# EAGLE design shield-module (EAGLE 5.12)
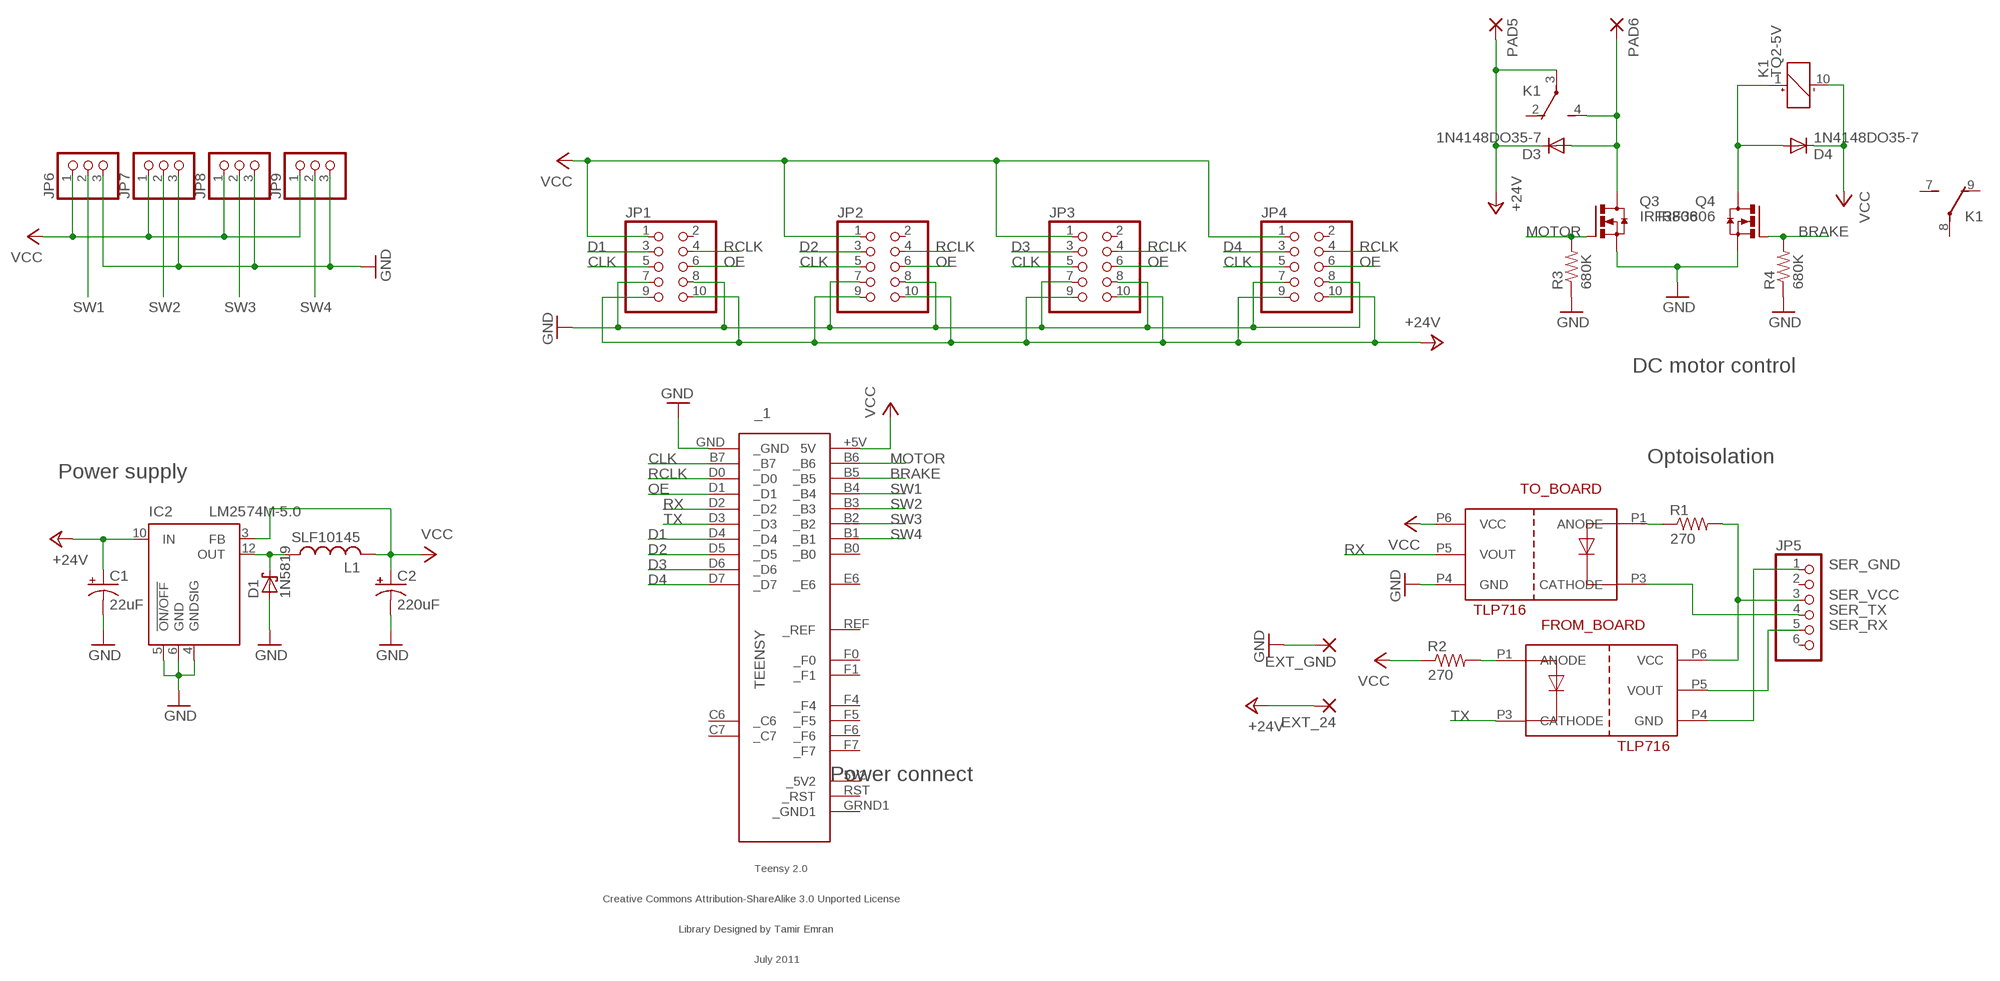
[diagram p0: schematic, sheet 1]

## Parts
_1  TEENSY  [TEENSY]
C1  22uF  CPOL-USSANYO_SMD_E7  [SANYO-OSCON_SMD_E7]
C2  220uF  CPOL-USSANYO_SMD_F8  [SANYO-OSCON_SMD_F8]
D1  1N5819  [SOD-123]
D3  1N4148DO35-7  DIODE-DO214AC  [DO214AC]
D4  1N4148DO35-7  DIODE-DO214AC  [DO214AC]
EXT_24  2,54/1,0  [2,54/1,0]
EXT_GND  2,54/1,0  [2,54/1,0]
FROM_BOARD  TLP716  [SDIP6]
IC2  LM2574M-5.0  [SO14W]
JP1  PINHD-2X5/90  [2X05/90]
JP2  PINHD-2X5/90  [2X05/90]
JP3  PINHD-2X5/90  [2X05/90]
JP4  PINHD-2X5/90  [2X05/90]
JP5  PINHD-1X6  [1X06]
JP6  PINHD-1X3  [1X03]
JP7  PINHD-1X3  [1X03]
JP8  PINHD-1X3  [1X03]
JP9  PINHD-1X3  [1X03]
K1  TQ2-5V  [TQ2]
L1  SLF10145  [SMD10145]
PAD5  2,54/1,0  [2,54/1,0]
PAD6  2,54/1,0  [2,54/1,0]
Q3  IRF3806  [DPAK]
Q4  IRF3806  [DPAK]
R1  270  R-US_R1206  [R1206]
R2  270  R-US_R1206  [R1206]
R3  680K  R-US_R1206  [R1206]
R4  680K  R-US_R1206  [R1206]
TO_BOARD  TLP716  [SDIP6]

## Nets
+24V: C1.+ D3.C EXT_24.1(P) IC2.10(IN) JP1.9 JP1.10 JP2.9 JP2.10 JP3.9 JP3.10 JP4.9 JP4.10 K1.3(1:P) PAD5.1(P)
BRAKE: _1.B5(_B5) Q4.1(G) R4.2
CLK: _1.B7(_B7) JP1.5 JP2.5 JP3.5 JP4.5
D1: _1.D4(_D4) JP1.3
D2: _1.D5(_D5) JP2.3
D3: _1.D6(_D6) JP3.3
D4: _1.D7(_D7) JP4.3
GND: _1.GND(_GND) C1.- C2.- D1.A EXT_GND.1(P) IC2.4(GNDSIG) IC2.5(!ON/OFF) IC2.6(GND) JP1.7 JP1.8 JP2.7 JP2.8 JP3.7 JP3.8 JP4.7 JP4.8 JP6.3 JP7.3 JP8.3 JP9.3 Q3.3(S) Q4.3(S) R3.1 R4.1 TO_BOARD.P4(GND)
MOTOR: _1.B6(_B6) Q3.1(G) R3.2
N$1: D1.C IC2.12(OUT) L1.P$1
N$3: R1.1 TO_BOARD.P1(ANODE)
N$7: FROM_BOARD.P1(ANODE) R2.2
N$53: D3.A K1.4(1:S) PAD6.1(P) Q3.4(D)
N$56: D4.A K1.1(_:+) Q4.4(D)
OE: _1.D1(_D1) JP1.6 JP2.6 JP3.6 JP4.6
RCLK: _1.D0(_D0) JP1.4 JP2.4 JP3.4 JP4.4
RX: _1.D2(_D2) TO_BOARD.P5(VOUT)
SER_GND: FROM_BOARD.P4(GND) JP5.1
SER_RX: FROM_BOARD.P5(VOUT) JP5.5
SER_TX: JP5.4 TO_BOARD.P3(CATHODE)
SER_VCC: FROM_BOARD.P6(VCC) JP5.3 R1.2
SW1: _1.B4(_B4) JP6.2
SW2: _1.B3(_B3) JP7.2
SW3: _1.B2(_B2) JP8.2
SW4: _1.B1(_B1) JP9.2
TX: _1.D3(_D3) FROM_BOARD.P3(CATHODE)
VCC: _1.+5V(5V) C2.+ D4.C IC2.3(FB) JP1.1 JP2.1 JP3.1 JP4.1 JP6.1 JP7.1 JP8.1 JP9.1 K1.10(_:-) L1.P$2 R2.1 TO_BOARD.P6(VCC)
Unconnected: _1.5V2(_5V2) _1.B0(_B0) _1.C6(_C6) _1.C7(_C7) _1.E6(_E6) _1.F0(_F0) _1.F1(_F1) _1.F4(_F4) _1.F5(_F5) _1.F6(_F6) _1.F7(_F7) _1.GRND1(_GND1) _1.REF(_REF) _1.RST(_RST) JP1.2 JP2.2 JP3.2 JP4.2 JP5.2 JP5.6 K1.2(1:O) K1.7(2:S) K1.8(2:P) K1.9(2:O)

## Notes on the sheet
- DC motor control
- Optoisolation
- Power supply
- SER_GND
- SER_VCC
- SER_TX
- SER_RX
- Power connect

## Library data of the parts
_1 = teensy:TEENSY: Teensy 2.0 Original Design by Clint Fisher Modified Design by Tamir Emran Licensed Under Creative Commons Attribution-ShareAlike 3.0 Unported (CC BY-SA 3.0)
C1 C2 = rcl:CPOL-US: POLARIZED CAPACITOR, American symbol
D1 = typewriter-project:1N5819
D3 D4 = diode:DIODE-: DIODE
EXT_24 EXT_GND PAD5 PAD6 = wirepad:2,54/1,0: THROUGH-HOLE PAD
FROM_BOARD TO_BOARD = typewriter-project:TLP716
IC2 = linear:LM2574?-*: SIMPLE SWITCHER 0.5A Step-Down Voltage Regulator Source: http://cache.national.com/ds/LM/LM2574.pdf
JP1-JP4 = pinhead:PINHD-2X5: PIN HEADER
JP5 = pinhead:PINHD-1X6: PIN HEADER
JP6-JP9 = pinhead:PINHD-1X3: PIN HEADER
K1 = relay:TQ2?*: LOW PROFILE 2 FORM C RELAY NAiS Source: http://www.mew-europe.com/.. en_ds_61020_0001.pdf Source: http://www.mew-europe.com/.. en_ds_61020_0004.pdf; MF: AROMAT/ MATSUSHITA; MPN: TQ2-5V; OC_FARNELL: 1175716; OC_NEWARK: 64K3200
L1 = typewriter-project:SLF10145
Q3 Q4 = typewriter-project:IRF*3806
R1-R4 = rcl:R-US_: RESISTOR, American symbol

## Board
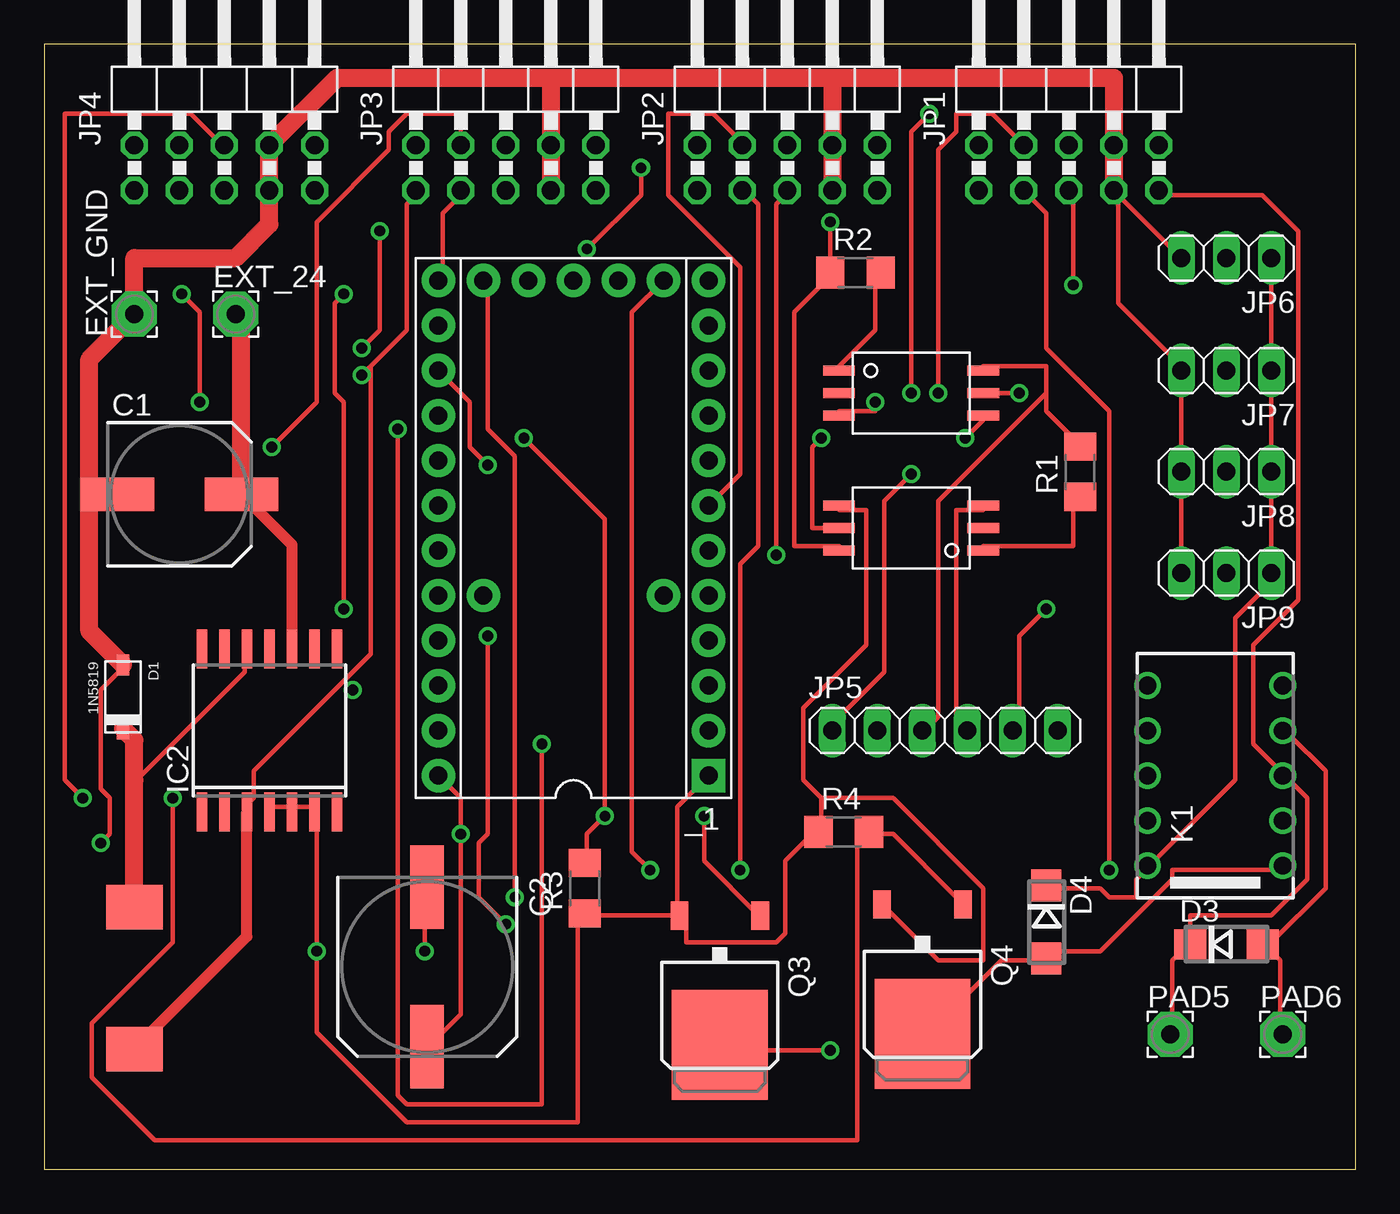
[diagram p1: board, top side]
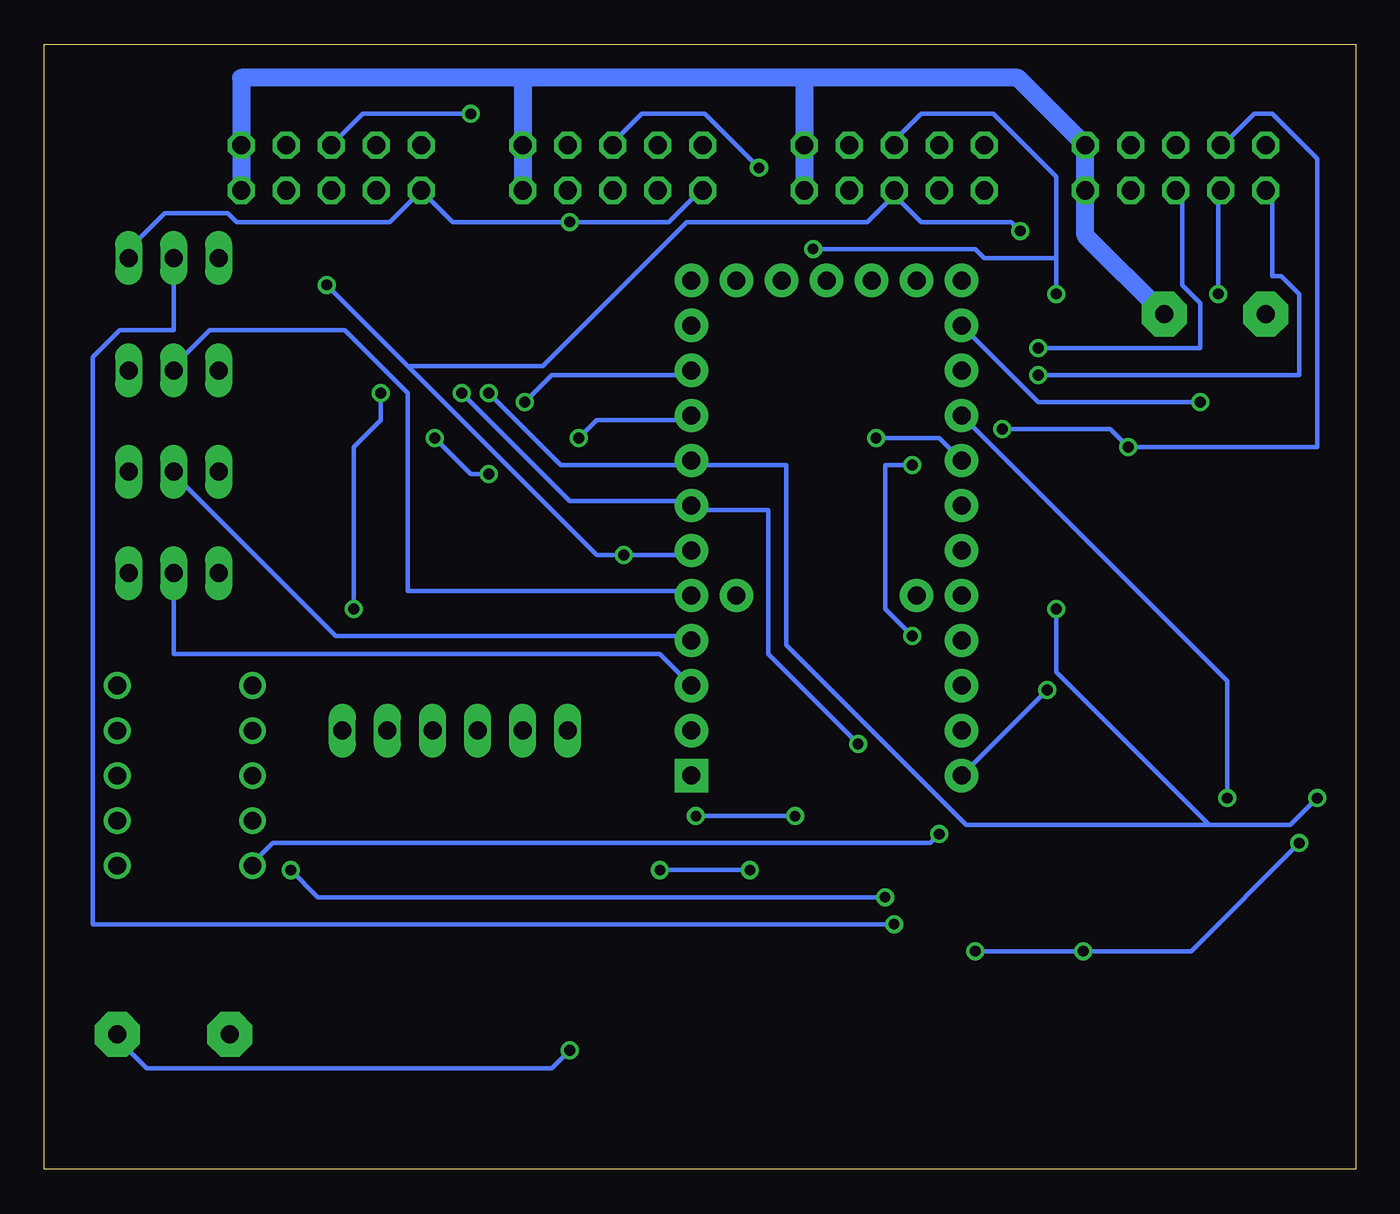
[diagram p2: board, bottom side, seen from below]

Size 73.97 x 63.49 mm. Coordinates in mm from the lower left corner, seen from the top.
Outline: 0,0 73.97,0 73.97,63.49 0,63.49 0,0
Copper layers (1*16): Top 0.035mm / dielectric 1.5mm / Bottom 0.035mm
Design rules "default *": minimum track width 10mil, minimum drill 24mil, track to track 16mil, track to pad 16mil, pad to pad 16mil, via to via 16mil, smd to smd 16mil, copper to edge 40mil, drill to drill 8mil, minimum pad ring 10mil, minimum via ring 8mil, stop-mask expansion 4mil, vias tented up to drill 0mil, thermal gap 10mil

### Footprints (pad centres in the part's own frame; a part is rotated, then mirrored left to right if it is on the bottom)
TEENSY = drill 1.016 pad 1.88 round: 5V2 13.97,-2.54; +5V -13.97,7.62; B0 -11.43,-7.62; B1 -8.89,-7.62; B2 -6.35,-7.62; B3 -3.81,-7.62; B4 8.89,7.62; B5 6.35,7.62; B6 3.81,7.62; B7 -1.27,-7.62; C6 11.43,-7.62; C7 13.97,-7.62; D0 1.27,-7.62; D1 3.81,-7.62; D2 6.35,-7.62; D3 8.89,-7.62; D4 13.97,5.08; D5 13.97,-5.08; D6 13.97,7.62; D7 11.43,7.62; E6 -3.81,-5.08; F0 -11.43,7.62; F1 -8.89,7.62; F4 -6.35,7.62; F5 -3.81,7.62; F6 -1.27,7.62; F7 1.27,7.62; GRND1 13.97,0; REF -3.81,5.08; RST 13.97,2.54 | drill 1.016 pad 1.88 square: GND -13.97,-7.62
SANYO-OSCON_SMD_E7 = smd 4.15 x 1.9: + 3.5,0; - -3.5,0
SANYO-OSCON_SMD_F8 = smd 4.7 x 1.9: + 4.5,0; - -4.5,0
SOD-123 = smd 1.2 x 0.7: A -1.8,0; C 1.8,0
DO214AC = smd 1.8 x 1.7: A 2.05,0; C -2.05,0
2,54/1,0 = drill 1.016 pad 2.54 octagon: 1 0,0
SDIP6 = smd 0.559 x 1.778: P1 1.27,4.064; P2 0,4.064; P3 -1.27,4.064; P4 -1.27,-4.064; P5 0,-4.064; P6 1.27,-4.064
SO14W = smd 0.6 x 2.2: 1 -3.81,-4.6; 2 -2.54,-4.6; 3 -1.27,-4.6; 4 0,-4.6; 5 1.27,-4.6; 6 2.54,-4.6; 7 3.81,-4.6; 8 3.81,4.6; 9 2.54,4.6; 10 1.27,4.6; 11 0,4.6; 12 -1.27,4.6; 13 -2.54,4.6; 14 -3.81,4.6
2X05/90 = drill 1.016 octagon: 1 -5.08,-6.35; 2 -5.08,-3.81; 3 -2.54,-6.35; 4 -2.54,-3.81; 5 0,-6.35; 6 0,-3.81; 7 2.54,-6.35; 8 2.54,-3.81; 9 5.08,-6.35; 10 5.08,-3.81
1X06 = drill 1.016 long: 1 -6.35,0; 2 -3.81,0; 3 -1.27,0; 4 1.27,0; 5 3.81,0; 6 6.35,0
1X03 = drill 1.016 long: 1 -2.54,0; 2 0,0; 3 2.54,0
TQ2 = drill 1 round: 1 -5.08,-3.81; 2 -2.54,-3.81; 3 0,-3.81; 4 2.54,-3.81; 5 5.08,-3.81; 6 5.08,3.81; 7 2.54,3.81; 8 0,3.81; 9 -2.54,3.81; 10 -5.08,3.81
SMD10145 = smd 3.2 x 2.5: P$1 0,4; P$2 0,-4
DPAK = smd 1 x 1.6: 1 -2.28,-7.34; 3 2.28,-7.34 | smd 5.4 x 6.2: 4 0,-0.04
R1206 = smd 1.6 x 1.803: 1 -1.422,0; 2 1.422,0

### Placement (x,y rotation side)
_1  29.85,36.2 90 top
C1  7.62,38.1 0 top
C2  21.59,11.43 270 top
D1  4.45,26.67 270 top
D3  66.68,12.7 0 top
D4  56.52,13.97 270 top
EXT_24  10.79,48.26 0 top
EXT_GND  5.08,48.26 90 top
FROM_BOARD  48.89,43.81 90 top
IC2  12.7,24.76 0 top
JP1  57.78,61.59 0 top
JP2  41.91,61.59 0 top
JP3  26.04,61.59 0 top
JP4  10.16,61.59 0 top
JP5  50.8,24.76 0 top
JP6  66.68,51.44 180 top
JP7  66.68,45.08 180 top
JP8  66.68,39.37 180 top
JP9  66.68,33.66 180 top
K1  66.04,22.22 90 top
L1  5.08,10.8 0 top
PAD5  63.5,7.62 0 top
PAD6  69.85,7.62 0 top
Q3  38.1,6.98 180 top
Q4  49.53,7.62 180 top
R1  58.42,39.37 90 top
R2  45.75,50.61 0 top
R3  30.48,15.88 90 top
R4  45.09,19.05 0 top
TO_BOARD  48.89,36.2 270 top

### Tracks (layer width: path | path; a pad name or v marks a point on that pad's centre or on a via)
+24V
  Top 0.254: PAD5.1 63.63,7.75 63.63,11.81 64.14,12.32 D3.C 64.64,12.83 64.64,14.35 69.22,14.35 71.25,16.38 71.25,20.96 70.23,21.97 K1.3 69.72,22.48 68.2,24 68.2,29.59 70.74,32.13 70.74,52.96 68.71,54.99 63.12,54.99 JP1.9
  Top 0.61: C1.+ 13.97,35.25 IC2.10
  Top 1.016: EXT_24.1 11.12,47.94 C1.+
  Bottom 1.016: EXT_24.1 15.24,52.7 JP4.9 JP4.10 19.05,61.59 31.12,61.59 | JP3.9 JP3.10 31.12,61.59 | JP2.9 JP2.10 46.99,61.59 | JP1.9 JP1.10 62.86,61.59 46.99,61.59 | 31.12,61.59 46.99,61.59
BRAKE  (via drill 0.61)
  Top 0.254: Q4.1 51.43,15.37 47.88,18.92 46.86,18.92 R4.2 46.35,18.92 45.85,18.42 45.85,1.65 6.22,1.65 2.67,5.21 2.67,8.25 7.24,12.83 v7.24,20.96
  Bottom 0.254: v7.24,20.96 7.24,27.56 _1.B5
CLK  (via drill 0.61)
  Top 0.254: v17.91,46.36 18.92,47.37 v18.92,52.96 | v41.27,34.67 41.27,54.48 41.78,54.99 JP2.5 | v58.04,49.91 58.04,54.99 JP1.5
  Bottom 0.254: v17.91,46.36 8.76,46.36 8.76,48.9 9.78,49.91 9.78,54.99 JP4.5 | v18.92,52.96 19.43,53.47 24.51,53.47 26.04,54.99 | _1.B7 37.72,34.67 v41.27,34.67 42.8,34.67 53.47,45.34 | 53.47,45.34 v58.04,49.91 | 26.04,54.99 27.56,53.47 37.72,53.47 45.85,45.34 53.47,45.34 | 26.04,54.99 JP3.5
D1  (via drill 0.61)
  Top 0.254: v60.07,16.89 60.07,42.8 56.52,46.36 56.52,53.98 JP1.3 | v26.54,15.37 26.54,40.26 25.02,41.78 25.02,49.91 _1.D4
  Bottom 0.254: v60.07,16.89 58.55,15.37 v26.54,15.37
D2  (via drill 0.61)
  Top 0.254: v39.24,16.89 39.24,34.16 40.26,35.18 40.26,54.48 39.75,54.99 JP2.3 | v34.16,16.89 33.15,17.91 33.15,48.39 _1.D5
  Bottom 0.254: v34.16,16.89 v39.24,16.89
D3
  Top 0.254: JP3.3 23.5,54.99 22.48,53.98 22.48,50.42 _1.D6
D4  (via drill 0.61)
  Top 0.254: v7.75,49.4 8.76,48.39 v8.76,43.31
  Bottom 0.254: v7.75,49.4 7.75,54.99 JP4.3 | v8.76,43.31 17.91,43.31 _1.D7
GND  (via drill 0.61)
  Top 0.254: 43.81,20.96 47.88,20.96 52.96,15.88 52.96,11.81 50.42,11.81 47.37,14.86 Q4.3 | 43.81,20.96 43.81,19.43 R4.1 43.31,18.92 41.78,17.4 41.78,13.34 41.27,12.83 36.2,12.83 36.2,13.84 Q3.3 35.69,14.35 | 43.81,20.96 42.8,21.97 42.8,26.04 46.35,29.59 46.35,37.21 44.83,37.21 TO_BOARD.P4 | 60.58,54.99 JP6.3 | JP9.3 JP8.3 JP7.3 64.14,45.34 60.58,48.9 60.58,54.99 | JP1.7 60.58,54.99 | 13.84,20.45 12.83,20.45 IC2.4 | 13.84,20.45 15.37,20.45 IC2.6 15.37,19.94 v15.37,12.32 15.37,7.75 20.45,2.67 30.1,2.67 30.1,14.35 R3.1 30.61,14.35 35.69,14.35 | 13.84,20.45 IC2.5 | 35.69,14.35 35.69,20.45 _1.GND | v21.46,12.32 21.46,15.88 C2.- | v3.17,18.42 3.68,18.92 3.68,20.96 3.17,21.46 3.17,27.05 4.19,28.07 D1.A
  Top 1.016: JP3.7 JP3.8 28.58,61.59 | 28.58,61.59 16.51,61.59 JP4.8 JP4.7 12.7,53.34 10.79,51.44 5.08,51.44 EXT_GND.1 2.54,45.72 2.54,38.1 | 28.58,61.59 44.45,61.59 | 44.45,61.59 60.32,61.59 JP1.8 JP1.7 | 44.45,61.59 JP2.8 JP2.7 | 2.54,38.1 C1.- | D1.A 2.54,30.38 2.54,38.1
  Bottom 0.254: v21.46,12.32 v15.37,12.32 9.27,12.32 v3.17,18.42
MOTOR  (via drill 0.61)
  Top 0.254: v37.21,19.94 37.21,17.4 40.26,14.35 Q3.1 | R3.2 30.61,17.4 30.61,18.92 v31.62,19.94 31.62,36.7 v27.05,41.28
  Bottom 0.254: v31.62,19.94 v37.21,19.94 | v27.05,41.28 23.5,41.28 _1.B6
N$1
  Top 0.254: IC2.12 11.3,29.08 11.3,28.07 5.21,21.97 5.08,21.97
  Top 1.016: D1.C 5.08,24.24 5.08,21.97 L1.P$1
N$3
  Top 0.254: TO_BOARD.P1 52.96,35.18 58.04,35.18 58.04,37.72 R1.1
N$7
  Top 0.254: FROM_BOARD.P1 44.83,45.34 46.86,47.37 46.86,50.42 R2.2
N$53  (via drill 0.61)
  Top 0.254: PAD6.1 69.72,7.75 69.72,11.81 69.22,12.32 D3.A 69.22,12.83 72.26,15.88 72.26,22.48 70.23,24.51 K1.4 | v44.32,6.73 38.23,6.73 Q3.4
  Bottom 0.254: v44.32,6.73 45.34,5.71 68.2,5.71 69.72,7.24 PAD6.1
N$56
  Top 0.254: Q4.4 49.91,7.75 53.98,11.81 56.52,11.81 D4.A 56.52,12.32 59.56,12.32 63.63,16.38 63.63,16.89 69.72,16.89 K1.1
OE  (via drill 0.61)
  Top 0.254: v30.61,51.94 33.66,54.99 v33.66,56.52 | v2.16,20.96 1.14,21.97 1.14,59.56 8.26,59.56 9.78,58.04 JP4.6 | v49.91,59.56 48.89,58.55 v48.89,43.81 | v16.89,49.4 16.38,48.9 16.38,43.81 16.89,43.31 v16.89,31.62
  Bottom 0.254: 16.89,51.44 16.89,56.01 20.45,59.56 24.51,59.56 26.04,58.04 JP3.6 | 16.89,51.44 20.96,51.44 21.46,51.94 v30.61,51.94 | v33.66,56.52 36.7,59.56 40.26,59.56 41.78,58.04 JP2.6 | v2.16,20.96 3.68,19.43 8.26,19.43 | 8.26,19.43 21.97,19.43 32.13,29.59 32.13,39.75 37.21,39.75 _1.D1 37.72,39.75 44.83,39.75 v48.89,43.81 | v49.91,59.56 56.01,59.56 JP1.6 | v16.89,49.4 16.89,51.44 | v16.89,31.62 16.89,28.07 8.26,19.43
RCLK  (via drill 0.61)
  Top 0.254: v12.83,40.77 15.37,43.31 15.37,53.47 19.43,57.53 19.43,58.55 20.45,59.56 23.5,59.56 JP3.4 | JP2.4 39.24,58.04 37.72,59.56 35.18,59.56 35.18,54.99 39.24,50.93 39.24,39.24 _1.D0 | v50.42,43.81 50.42,57.53 51.43,58.55 51.43,59.56 53.47,59.56 JP1.4 | v19.94,41.78 19.94,4.19 20.45,3.68 28.07,3.68 v28.07,24
  Bottom 0.254: JP4.4 7.24,58.04 5.71,59.56 4.7,59.56 2.16,57.02 2.16,40.77 v12.83,40.77 13.84,41.78 v19.94,41.78 | v50.42,43.81 44.32,37.72 37.72,37.72 _1.D0 37.21,37.21 33.15,37.21 33.15,29.08 v28.07,24
RX  (via drill 0.61)
  Top 0.254: TO_BOARD.P5 43.31,36.2 43.31,40.77 v43.81,41.28
  Bottom 0.254: v43.81,41.28 42.8,42.29 37.72,42.29 _1.D2
SER_GND  (via drill 0.61)
  Top 0.254: v51.94,41.28 52.96,42.29 FROM_BOARD.P4 | v48.89,39.24 47.37,37.72 47.37,28.07 44.83,25.53 44.83,25.02 JP5.1
  Bottom 0.254: v51.94,41.28 49.91,39.24 v48.89,39.24
SER_RX  (via drill 0.61)
  Top 0.254: v54.99,43.81 FROM_BOARD.P5 | v56.52,31.62 54.99,30.1 54.99,25.02 JP5.5
  Bottom 0.254: v54.99,43.81 54.99,42.29 56.52,40.77 v56.52,31.62
SER_TX
  Top 0.254: TO_BOARD.P3 52.96,37.21 51.43,37.21 51.43,25.53 51.94,25.02 JP5.4
SER_VCC
  Top 0.254: 56.52,43.81 56.52,42.8 58.04,41.28 R1.2 | 56.52,43.81 56.52,45.34 52.96,45.34 FROM_BOARD.P6 | 56.52,43.81 50.42,37.72 50.42,25.53 49.91,25.02 JP5.3
SW1  (via drill 0.61)
  Top 0.254: v26.04,13.84 24.51,15.37 24.51,18.42 25.02,18.92 v25.02,30.1 | v25.02,39.75 24,40.77 24,43.31 _1.B4
  Bottom 0.254: JP6.2 66.68,47.37 69.72,47.37 71.25,45.85 71.25,13.84 v26.04,13.84 | v25.02,30.1 26.54,31.62 26.54,39.75 v25.02,39.75
SW2
  Bottom 0.254: JP7.2 66.68,45.34 64.64,47.37 57.02,47.37 53.47,43.81 53.47,32.64 37.72,32.64 _1.B3
SW3
  Bottom 0.254: JP8.2 66.68,39.24 57.53,30.1 37.72,30.1 _1.B2
SW4
  Bottom 0.254: JP9.2 66.68,29.08 39.24,29.08 _1.B1
TX  (via drill 0.61)
  Top 0.254: v46.86,43.31 46.86,42.8 44.83,42.8 FROM_BOARD.P3
  Bottom 0.254: v46.86,43.31 45.34,44.83 37.72,44.83 _1.D3
VCC  (via drill 0.61)
  Top 0.254: _1.+5V 23.5,20.96 v23.5,18.92 23.5,8.76 21.97,7.24 C2.+ | 18.42,45.34 20.45,47.37 20.45,54.48 20.96,54.99 JP3.1 | 18.42,45.34 v17.91,44.83 | 16.89,27.56 18.42,29.08 18.42,45.34 | 16.89,27.56 11.81,22.48 11.81,20.96 11.3,20.45 IC2.3 | 16.89,27.56 v17.4,27.05 | TO_BOARD.P6 44.83,35.18 42.29,35.18 42.29,48.39 44.32,50.42 R2.1 44.32,50.93 v44.32,53.47 | D4.C 56.52,15.88 59.56,15.88 60.07,15.37 61.59,15.37 61.59,16.38 62.1,16.89 K1.10 62.61,17.4 67.18,21.97 67.18,31.11 69.22,33.15 JP9.1 JP8.1 JP7.1 JP6.1
  Top 0.61: L1.P$2 11.43,13.14 IC2.3
  Bottom 0.254: v17.91,44.83 3.17,44.83 3.17,49.4 4.19,50.42 4.7,50.42 4.7,54.99 JP4.1 | v17.4,27.05 _1.+5V | JP2.1 37.21,54.99 38.73,53.47 v44.32,53.47 50.93,53.47 JP1.1 54.48,53.47 63.12,53.47 63.63,53.98 67.18,53.98 69.22,51.94 JP6.1 | v23.5,18.92 24,18.42 61.09,18.42 62.1,17.4 K1.10